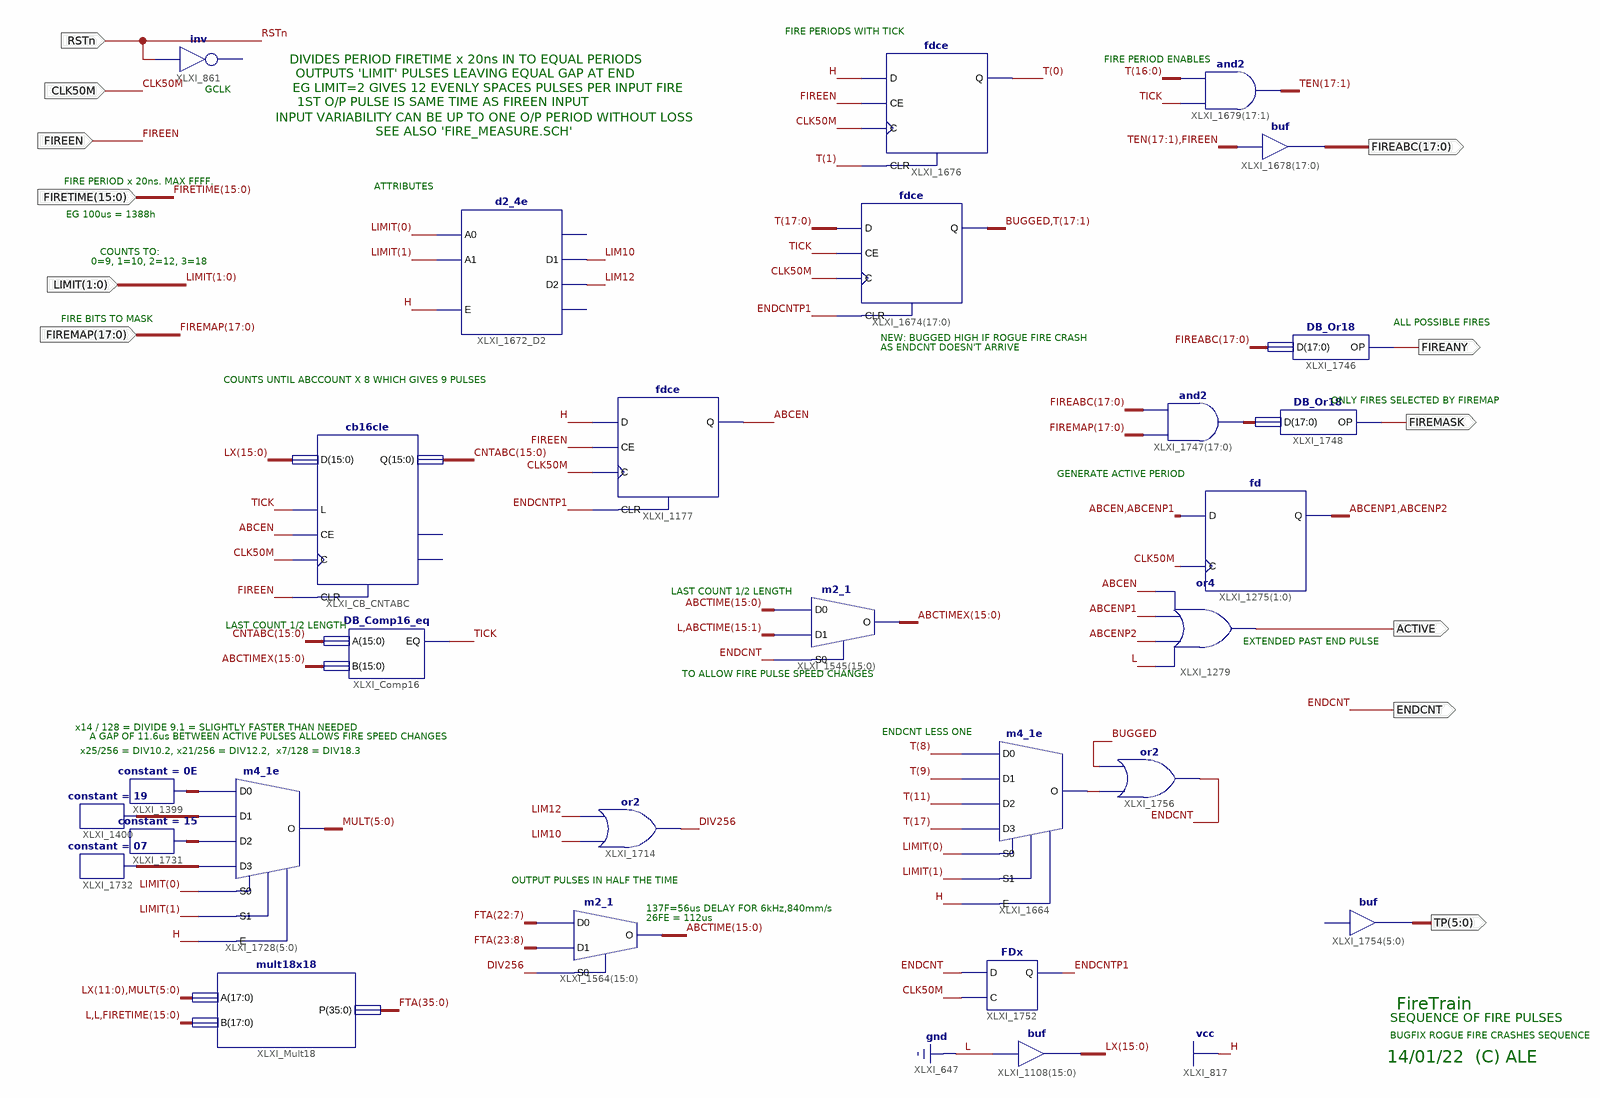
[diagram p0: schematic sheet 1]
// Xilinx ISE schematic DB_FireTrain.sch (spartan3e) as structural Verilog: 28 symbols, 12 ports
module DB_FireTrain (
  input  RSTn,
  input  CLK50M,
  input  [1:0] LIMIT,
  input  FIREEN,
  input  [17:0] FIREMAP,
  input  [15:0] FIRETIME,
  output ENDCNT,
  output [17:0] FIREABC,
  output FIREANY,
  output FIREMASK,
  output ACTIVE,
  output [5:0] TP
);

  wire ABCEN, ABCENP1, ABCENP2, BUGGED, DIV256, ENDCNTP1, LIM10, LIM12, TICK, XLXN_2595;
  wire [5:0] MULT, XLXN_1827, XLXN_1828, XLXN_2480, XLXN_2481;
  wire [15:0] ABCTIME, ABCTIMEX, CNTABC, LX;
  wire [17:0] T, XLXN_2543;
  wire [17:1] TEN;
  wire [35:0] FTA;

  // inv XLXI_861 has open pins: I=RSTn, O=open
  assign FIREABC = {TEN, FIREEN};  // buf XLXI_1678[17..0], 18 bits wide
  assign TEN = {17{TICK}} & T[16:0];  // and2 XLXI_1679[17..1], 17 bits wide
  constant #(.CValue("0E")) XLXI_1399 (.O(XLXN_1827));
  constant #(.CValue("19")) XLXI_1400 (.O(XLXN_1828));
  m4_1e XLXI_1728[5:0] (
    .D0(XLXN_1827), .D1(XLXN_1828), .D2(XLXN_2480), .D3(XLXN_2481), .E(1'b1), .S0(LIMIT[0]), .S1(LIMIT[1]),
    .O(MULT));
  mult18x18 XLXI_Mult18 (.A({LX[11:0], MULT}), .B({2'b00, FIRETIME}), .P(FTA));
  constant #(.CValue("15")) XLXI_1731 (.O(XLXN_2480));
  constant #(.CValue("07")) XLXI_1732 (.O(XLXN_2481));
  or XLXI_1714 (DIV256, LIM10, LIM12);
  m2_1 XLXI_1564[15:0] (.D0(FTA[22:7]), .D1(FTA[23:8]), .S0(DIV256), .O(ABCTIME));
  DB_Comp16_eq XLXI_Comp16 (.A(CNTABC), .B(ABCTIMEX), .EQ(TICK));
  fdce XLXI_1177 (.C(CLK50M), .CE(FIREEN), .CLR(ENDCNTP1), .D(1'b1), .Q(ABCEN));
  cb16cle XLXI_CB_CNTABC (.C(CLK50M), .CE(ABCEN), .CLR(FIREEN), .D(LX), .L(TICK), .Q(CNTABC));  // open: CEO, TC
  m2_1 XLXI_1545[15:0] (.D0(ABCTIME), .D1({1'b0, ABCTIME[15:1]}), .S0(ENDCNT), .O(ABCTIMEX));
  DB_Or18 XLXI_1746 (.D(FIREABC), .OP(FIREANY));
  assign XLXN_2543 = FIREMAP & FIREABC;  // and2 XLXI_1747[17..0], 18 bits wide
  DB_Or18 XLXI_1748 (.D(XLXN_2543), .OP(FIREMASK));
  fd XLXI_1275[1:0] (.C(CLK50M), .D({ABCEN, ABCENP1}), .Q({ABCENP1, ABCENP2}));
  or XLXI_1279 (ACTIVE, 1'b0, ABCENP2, ABCENP1, ABCEN);
  fdce XLXI_1676 (.C(CLK50M), .CE(FIREEN), .CLR(T[1]), .D(1'b1), .Q(T[0]));
  d2_4e XLXI_1672_D2 (.A0(LIMIT[0]), .A1(LIMIT[1]), .E(1'b1), .D1(LIM10), .D2(LIM12));  // open: D0, D3
  m4_1e XLXI_1664 (.D0(T[8]), .D1(T[9]), .D2(T[11]), .D3(T[17]), .E(1'b1), .S0(LIMIT[0]), .S1(LIMIT[1]), .O(XLXN_2595));
  assign LX = {16{1'b0}};  // buf XLXI_1108[15..0], 16 bits wide
  // buf XLXI_1754[5..0] has open pins: I=open, O=TP
  FDx XLXI_1752 (.C(CLK50M), .D(ENDCNT), .Q(ENDCNTP1));
  fdce XLXI_1674[17:0] (.C(CLK50M), .CE(TICK), .CLR(ENDCNTP1), .D(T), .Q({BUGGED, T[17:1]}));
  or XLXI_1756 (ENDCNT, XLXN_2595, BUGGED);

  // Notes on the sheet:
  //   FIRE PERIODS WITH TICK
  //   DIVIDES PERIOD FIRETIME x 20ns IN TO EQUAL PERIODS
  //   FIRE PERIOD ENABLES
  //   OUTPUTS 'LIMIT' PULSES LEAVING EQUAL GAP AT END
  //   EG LIMIT=2 GIVES 12 EVENLY SPACES PULSES PER INPUT FIRE
  //   GCLK
  //   1ST O/P PULSE IS SAME TIME AS FIREEN INPUT
  //   INPUT VARIABILITY CAN BE UP TO ONE O/P PERIOD WITHOUT LOSS
  //   SEE ALSO 'FIRE_MEASURE.SCH'
  //   FIRE PERIOD x 20ns. MAX FFFF.
  //   ATTRIBUTES
  //   EG 100us = 1388h
  //   COUNTS TO:
  //   0=9, 1=10, 2=12, 3=18
  //   FIRE BITS TO MASK
  //   ALL POSSIBLE FIRES
  //   NEW: BUGGED HIGH IF ROGUE FIRE CRASH
  //   AS ENDCNT DOESN'T ARRIVE
  //   COUNTS UNTIL ABCCOUNT X 8 WHICH GIVES 9 PULSES
  //   ONLY FIRES SELECTED BY FIREMAP
  //   GENERATE ACTIVE PERIOD
  //   LAST COUNT 1/2 LENGTH
  //   LAST COUNT 1/2 LENGTH
  //   EXTENDED PAST END PULSE
  //   TO ALLOW FIRE PULSE SPEED CHANGES
  //   x14 / 128 = DIVIDE 9.1 = SLIGHTLY FASTER THAN NEEDED
  //   ENDCNT LESS ONE
  //   A GAP OF 11.6us BETWEEN ACTIVE PULSES ALLOWS FIRE SPEED CHANGES
  //   x25/256 = DIV10.2, x21/256 = DIV12.2,  x7/128 = DIV18.3
  //   OUTPUT PULSES IN HALF THE TIME
  //   137F=56us DELAY FOR 6kHz,840mm/s
  //   26FE = 112us
  //   FireTrain
  //   SEQUENCE OF FIRE PULSES
  //   BUGFIX ROGUE FIRE CRASHES SEQUENCE
  //   14/01/22  (C) ALE
endmodule
